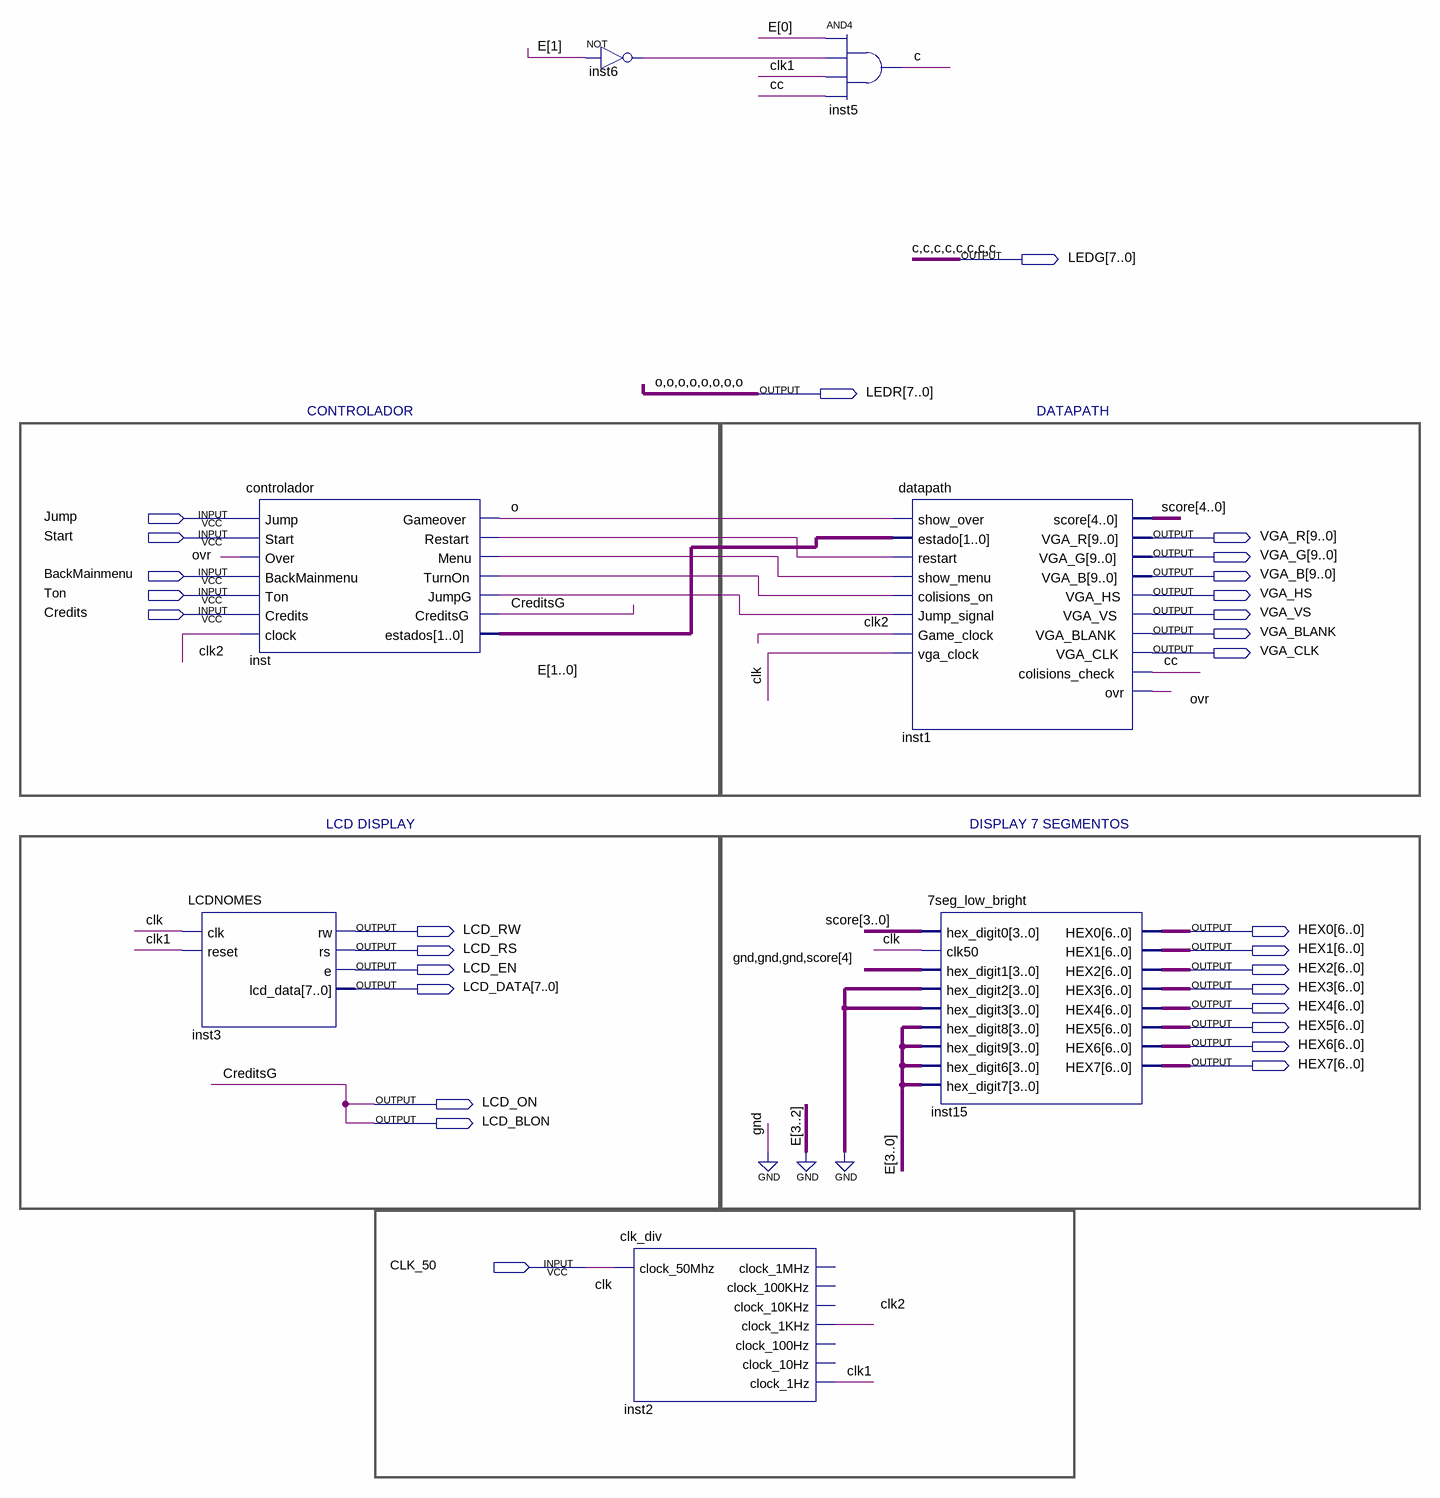
[diagram p0: schematic sheet]
// Quartus schematic processor.bdf as structural Verilog: 7 symbols, 29 pins
module processor (
  input  Jump,
  input  Start,
  input  BackMainmenu,
  input  Ton,
  input  Credits,
  input  CLK_50,
  output [7:0] LEDG,
  output [7:0] LEDR,
  output [9:0] VGA_R,
  output [9:0] VGA_G,
  output [9:0] VGA_B,
  output VGA_HS,
  output VGA_VS,
  output VGA_BLANK,
  output VGA_CLK,
  output LCD_RW,
  output [6:0] HEX0,
  output LCD_RS,
  output [6:0] HEX1,
  output LCD_EN,
  output [6:0] HEX2,
  output [7:0] LCD_DATA,
  output [6:0] HEX3,
  output [6:0] HEX4,
  output [6:0] HEX5,
  output [6:0] HEX6,
  output [6:0] HEX7,
  output LCD_ON,
  output LCD_BLON
);

  wire cc, clk1, clk2, inst6_out, inst_jumpg, inst_menu, inst_restart, inst_turnon, ovr;
  wire [1:0] E;
  wire [4:0] score;

  LCDNOMES inst3 (.clk(CLK_50), .reset(clk1), .rw(LCD_RW), .rs(LCD_RS), .e(LCD_EN), .lcd_data(LCD_DATA));
  controlador inst (
    .Jump(Jump), .Start(Start), .Over(ovr), .BackMainmenu(BackMainmenu), .Ton(Ton), .Credits(Credits),
    .clock(clk2), .Gameover(LEDR[7]), .Restart(inst_restart), .Menu(inst_menu), .TurnOn(inst_turnon),
    .JumpG(inst_jumpg), .CreditsG(LCD_BLON), .estados(E));
  not inst6 (inst6_out, E[1]);
  clk_div inst2 (
    .clock_50Mhz(CLK_50), .clock_1KHz(clk2), .clock_1Hz(clk1));  // open: clock_1MHz, clock_100KHz, clock_10KHz, clock_100Hz, clock_10Hz
  and inst5 (LEDG[7], E[0], inst6_out, clk1, cc);
  datapath inst1 (
    .show_over(LEDR[7]), .estado(E), .restart(inst_restart), .show_menu(inst_menu),
    .colisions_on(inst_turnon), .Jump_signal(inst_jumpg), .Game_clock(clk2), .vga_clock(CLK_50),
    .score(score), .VGA_R(VGA_R), .VGA_G(VGA_G), .VGA_B(VGA_B), .VGA_HS(VGA_HS), .VGA_VS(VGA_VS),
    .VGA_BLANK(VGA_BLANK), .VGA_CLK(VGA_CLK), .colisions_check(cc), .ovr(ovr));
  \7seg_low_bright  inst15 (
    .hex_digit0(score[3:0]), .clk50(CLK_50), .hex_digit1({3'b000, score[4]}), .hex_digit2(4'b0000),
    .hex_digit3(4'b0000), .hex_digit8({2'b00, E}), .hex_digit9({2'b00, E}), .hex_digit6({2'b00, E}),
    .hex_digit7({2'b00, E}), .HEX0(HEX0), .HEX1(HEX1), .HEX2(HEX2), .HEX3(HEX3), .HEX4(HEX4), .HEX5(HEX5),
    .HEX6(HEX6), .HEX7(HEX7));

  assign LCD_ON = LCD_BLON;
  assign LEDG[6:0] = {7{LEDG[7]}};
  assign LEDR[6:0] = {7{LEDR[7]}};

  // Other names for the same wires on the sheet: c = LEDG[7]; clk = CLK_50; CreditsG = LCD_BLON; o = LEDR[7]

  // Notes on the sheet:
  //   CONTROLADOR
  //   DATAPATH
  //   LCD DISPLAY
  //   DISPLAY 7 SEGMENTOS
endmodule
